# Altium schematic sheet 03 - Lattice_FPGA.SchDoc
size A4; DocumentNumber: 1; SheetNumber: 1; SheetTotal: 3; SchemaTitle: Lattice FPGA
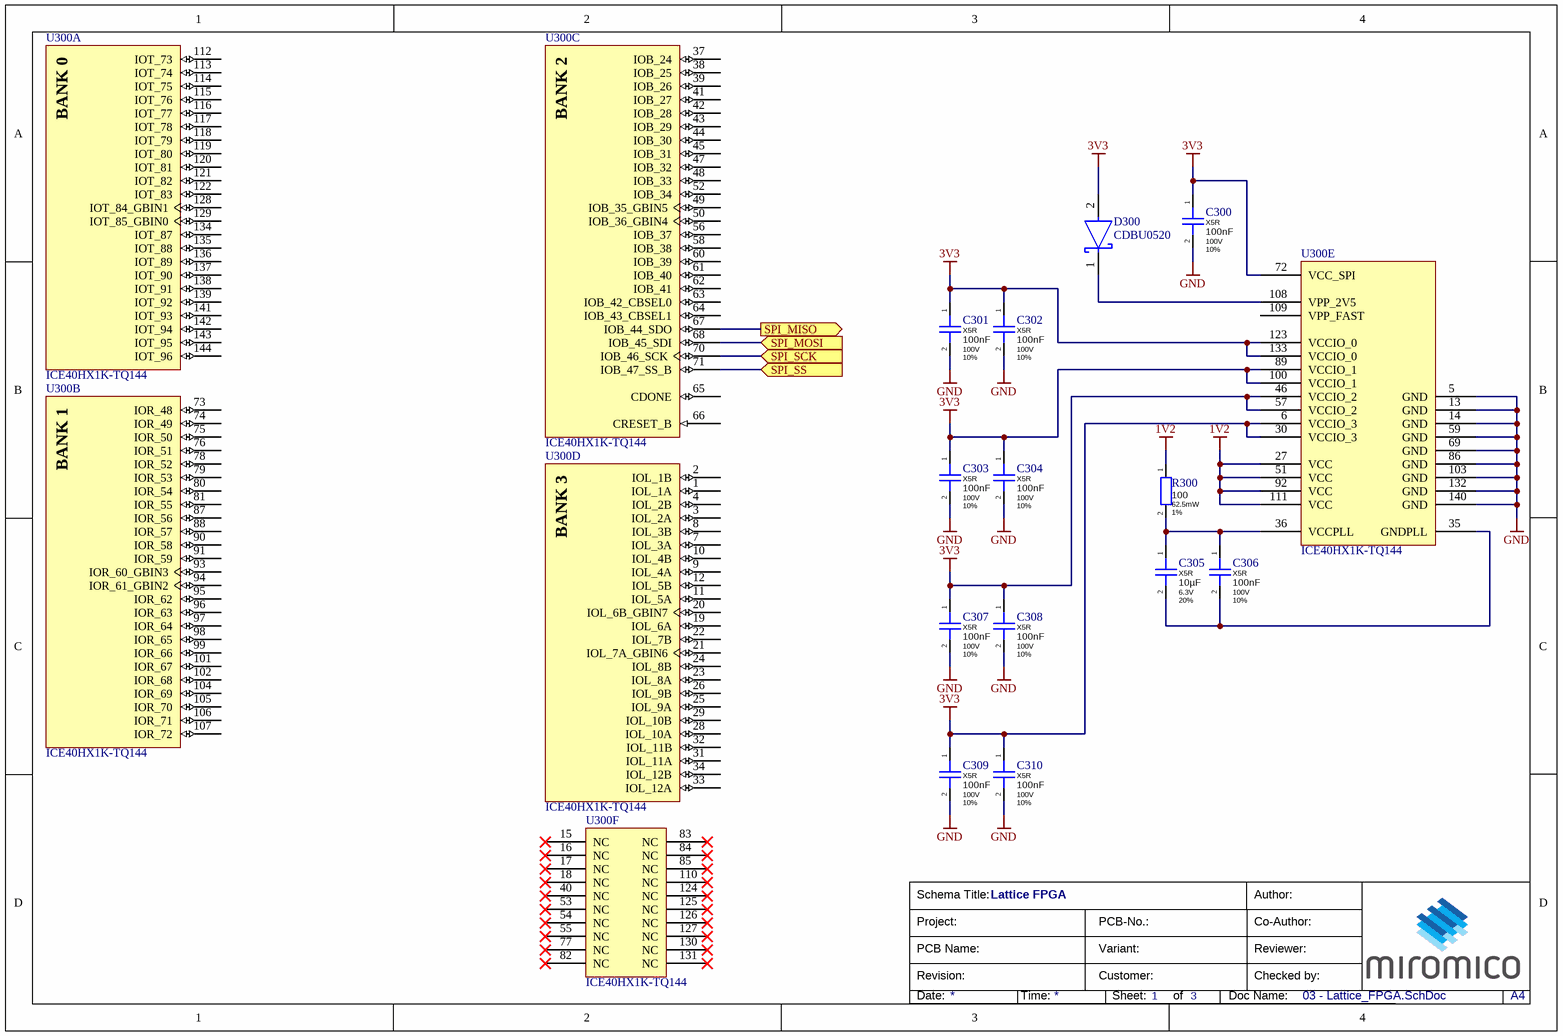
[diagram p0: 03 - Lattice_FPGA.SchDoc]

## Parts
C300  Dielectric: X5R  Capacitance: 100nF  Voltage Rating: 100V  Tolerance: 10%  [CAPC0402(1005)60_L]  (hidden comment: GRM155R62A104KE14D)
C301  Dielectric: X5R  Capacitance: 100nF  Voltage Rating: 100V  Tolerance: 10%  [CAPC0402(1005)60_L]  (hidden comment: GRM155R62A104KE14D)
C302  Dielectric: X5R  Capacitance: 100nF  Voltage Rating: 100V  Tolerance: 10%  [CAPC0402(1005)60_L]  (hidden comment: GRM155R62A104KE14D)
C303  Dielectric: X5R  Capacitance: 100nF  Voltage Rating: 100V  Tolerance: 10%  [CAPC0402(1005)60_L]  (hidden comment: GRM155R62A104KE14D)
C304  Dielectric: X5R  Capacitance: 100nF  Voltage Rating: 100V  Tolerance: 10%  [CAPC0402(1005)60_L]  (hidden comment: GRM155R62A104KE14D)
C305  Dielectric: X5R  Capacitance: 10µF  Voltage Rating: 6.3V  Tolerance: 20%  [CAPC0402(1005)60_L]  (hidden comment: GRJ155R60J106ME11D)
C306  Dielectric: X5R  Capacitance: 100nF  Voltage Rating: 100V  Tolerance: 10%  [CAPC0402(1005)60_L]  (hidden comment: GRM155R62A104KE14D)
C307  Dielectric: X5R  Capacitance: 100nF  Voltage Rating: 100V  Tolerance: 10%  [CAPC0402(1005)60_L]  (hidden comment: GRM155R62A104KE14D)
C308  Dielectric: X5R  Capacitance: 100nF  Voltage Rating: 100V  Tolerance: 10%  [CAPC0402(1005)60_L]  (hidden comment: GRM155R62A104KE14D)
C309  Dielectric: X5R  Capacitance: 100nF  Voltage Rating: 100V  Tolerance: 10%  [CAPC0402(1005)60_L]  (hidden comment: GRM155R62A104KE14D)
C310  Dielectric: X5R  Capacitance: 100nF  Voltage Rating: 100V  Tolerance: 10%  [CAPC0402(1005)60_L]  (hidden comment: GRM155R62A104KE14D)
D300  CDBU0520  [FP-0603-SOD-523F-MFG]
R300  Resistance: 100  Power Rating: 62.5mW  Tolerance: 1%  [RESC0402(1005)_L]  (hidden comment: RC0402FR-07100RL)
U300  ICE40HX1K-TQ144  [LATC-TQFP-144_L]  (parts A,B,C,D,E,F of 6)

## Ports
SPI_MISO (out), SPI_MOSI (in), SPI_SCK (in), SPI_SS (in)

## Nets
1V2: R300.1 U300.27(VCC) U300.51(VCC) U300.92(VCC) U300.111(VCC)
3V3: C300.1 C301.1 C302.1 C303.1 C304.1 C307.1 C308.1 C309.1 C310.1 D300.2(A) U300.6(VCCIO_3) U300.30(VCCIO_3) U300.46(VCCIO_2) U300.57(VCCIO_2) U300.72(VCC_SPI) U300.89(VCCIO_1) U300.100(VCCIO_1) U300.123(VCCIO_0) U300.133(VCCIO_0)
GND: C300.2 C301.2 C302.2 C303.2 C304.2 C307.2 C308.2 C309.2 C310.2 U300.5(GND) U300.13(GND) U300.14(GND) U300.59(GND) U300.69(GND) U300.86(GND) U300.103(GND) U300.132(GND) U300.140(GND)
SPI_MISO: U300.67(IOB_44_SDO) ; port SPI_MISO
SPI_MOSI: U300.68(IOB_45_SDI) ; port SPI_MOSI
SPI_SCK: U300.70(IOB_46_SCK) ; port SPI_SCK
SPI_SS: U300.71(IOB_47_SS_B) ; port SPI_SS
NetC305_1: C305.1 C306.1 R300.2 U300.36(VCCPLL)
NetC305_2: C305.2 C306.2 U300.35(GNDPLL)
NetD300_1: D300.1(C) U300.108(VPP_2V5)

Not connected (* = marked no-connect by the designer): U300 1(IOL_1A) 2(IOL_1B) 3(IOL_2A) 4(IOL_2B) 7(IOL_3A) 8(IOL_3B) 9(IOL_4A) 10(IOL_4B) 11(IOL_5A) 12(IOL_5B) 15(NC)* 16(NC)* 17(NC)* 18(NC)* 19(IOL_6A) 20(IOL_6B_GBIN7) 21(IOL_7A_GBIN6) 22(IOL_7B) 23(IOL_8A) 24(IOL_8B) 25(IOL_9A) 26(IOL_9B) 28(IOL_10A) 29(IOL_10B) 31(IOL_11A) 32(IOL_11B) 33(IOL_12A) 34(IOL_12B) 37(IOB_24) 38(IOB_25) 39(IOB_26) 40(NC)* 41(IOB_27) 42(IOB_28) 43(IOB_29) 44(IOB_30) 45(IOB_31) 47(IOB_32) 48(IOB_33) 49(IOB_35_GBIN5) 50(IOB_36_GBIN4) 52(IOB_34) 53(NC)* 54(NC)* 55(NC)* 56(IOB_37) 58(IOB_38) 60(IOB_39) 61(IOB_40) 62(IOB_41) 63(IOB_42_CBSEL0) 64(IOB_43_CBSEL1) 65(CDONE) 66(CRESET_B) 73(IOR_48) 74(IOR_49) 75(IOR_50) 76(IOR_51) 77(NC)* 78(IOR_52) 79(IOR_53) 80(IOR_54) 81(IOR_55) 82(NC)* 83(NC)* 84(NC)* 85(NC)* 87(IOR_56) 88(IOR_57) 90(IOR_58) 91(IOR_59) 93(IOR_60_GBIN3) 94(IOR_61_GBIN2) 95(IOR_62) 96(IOR_63) 97(IOR_64) 98(IOR_65) 99(IOR_66) 101(IOR_67) 102(IOR_68) 104(IOR_69) 105(IOR_70) 106(IOR_71) 107(IOR_72) 109(VPP_FAST) 110(NC)* 112(IOT_73) 113(IOT_74) 114(IOT_75) 115(IOT_76) 116(IOT_77) 117(IOT_78) 118(IOT_79) 119(IOT_80) 120(IOT_81) 121(IOT_82) 122(IOT_83) 124(NC)* 125(NC)* 126(NC)* 127(NC)* 128(IOT_84_GBIN1) 129(IOT_85_GBIN0) 130(NC)* 131(NC)* 134(IOT_87) 135(IOT_88) 136(IOT_89) 137(IOT_90) 138(IOT_91) 139(IOT_92) 141(IOT_93) 142(IOT_94) 143(IOT_95) 144(IOT_96)

## Notes on the sheet
- Schema Title:
- Project:
- PCB-No.:
- Author:
- Co-Author:
- Revision:
- PCB Name:
- Customer:
- Variant:
- Reviewer:
- Checked by:
- Date:
- Time:
- Sheet:
- of
- Doc Name:
- A4
- (in symbol CMP-0962-00009-1, part A) BANK 0
- (in symbol CMP-0962-00009-1, part B) BANK 1
- (in symbol CMP-0962-00009-1, part C) BANK 2
- (in symbol CMP-0962-00009-1, part D) BANK 3

## Library data of the parts
C300-C304 C306-C310 = CMP-00636-01: 0.1µF ±10% 100V Ceramic Capacitor X5R 0402 (1005 Metric); Manufacturer: Murata Electronics; RoHS Compliant: Yes; Mount: Surface Mount; Max Operating Temperature: 85°C; Min Operating Temperature: -55°C; Supplier Part Number 1: 490-10458-1-ND; Case/Package: 0402; Length: 0.039inch; Manufacturer Part Number: GRM155R62A104KE14D; Termination: SMD/SMT; Thickness: 0.022inch; ComponentLink1Description: Datasheet; Packaging: Tape and Reel; Height: 0.5mm; Package Quantity: 10000; Supplier 1: Digi-Key; Case Code (Imperial): 0402; Lead Free: Lead Free; Case Code (Metric): 1005; Voltage Rating (DC): 100V; Width: 0.5mm; Weight: 0.000212oz; REACH SVHC: No SVHC
C305 = CMP-00462-01: 10µF ±20% 6.3V Ceramic Capacitor X5R 0402 (1005 Metric); Manufacturer: Murata Electronics; Case Code (Metric): 1005; Supplier 1: Digi-Key; Length: 0.039inch; Case Code (Imperial): 0402; Mount: Surface Mount; Min Operating Temperature: -55°C; ComponentLink1Description: Datasheet; Max Operating Temperature: 85°C; Packaging: Cut Tape; Supplier Part Number 1: 490-13211-1-ND; Thickness: 0.028inch; Manufacturer Part Number: GRJ155R60J106ME11D; Features: Soft Termination; Case/Package: 0402; Width: 0.02inch
D300 = CMP-20227-000003-1: DIODE SCHOTTKY 20V 500MA 0603; Max Surge Current: 2A; Max Reverse Leakage Current: 100uA; Package Quantity: 1; Packaging: Tape and Reel; Mount: Surface Mount; Max Reverse Voltage (DC): 20V; Average Rectified Current: 500mA; Case/Package: SMD/SMT
R300 = CMP-00556-01: 100 Ohms ±1% 0.063W, 1/16W Chip Resistor 0402 (1005 Metric)  Thick Film; Manufacturer: Yageo; Voltage Rating (DC): 50V; Max Power Dissipation: 63mW; Temperature Coefficient: 100ppm/°C; Max Operating Temperature: 155°C; ComponentLink1Description: Datasheet; Military Standard: Not; Case Code (Metric): 1005; Technology: THICK FILM; Size Code: 0402; Resistance Tolerance: 1%; Case/Package: 0402; Construction: Rectangular; Features: Moisture Resistant; Series: RC; Supplier 1: Digi-Key; Number of Terminations: 2; Case Code (Imperial): 0402; Manufacturer Part Number: RC0402FR-07100RL; Supplier Part Number 1: 311-100LRCT-ND; Depth: 0.5mm; Packaging: Tape and Reel; Number of Pins: 2; Min Operating Temperature: -55°C; Width: 0.5mm; Termination: SMD/SMT; REACH SVHC: No SVHC; Resistor Type: Thick Film; Voltage Rating: 50V; Height: 0.32mm; Length: 1mm; Lead Free: Lead Free
U300 = CMP-0962-00009-1: iCE40 HX1K Series FPGA Family, 1280 Logic Cells, 1.2 V Core, 64 K Embedded RAM Bits, 144-pin TQFP, Pb-Free, Tray; Manufacturer: Lattice Semiconductor; Embedded RAM Bits: 64K; Logic Cells: 1280; Phase-Locked Loops: 1; Supply Voltage: 1.2V; Mounting Technology: Surface Mount; ComponentLink3URL: http://www.latticesemi.com/lit/docs/package/pkg.pdf; ComponentLink1URL: http://www.latticesemi.com/en; ComponentLink2Description: Datasheet; RoHS: TRUE; ComponentLink2URL: http://www.latticesemi.com/~/media/Documents/DataSheets/iCE/iCE40LPHXFamilyDataSheet.pdf; PackageVersion: Rev. 03.9, 02/2013; ComponentLink1Description: Manufacturer URL; PartNumber: ICE40HX1K-TQ144; DatasheetVersion: Rev. 02.9; PackageReference: TQFP-144; PackageDescription: 144-Pin Thin Quad Flat Package, Body 20 x 20 mm, Pitch 0.5 mm; Packing: Tray; ComponentLink3Description: Package Specification